# Altium schematic sheet Main.SchDoc
size A4; DocumentNumber: 1; SheetNumber: 1; SheetTotal: 6
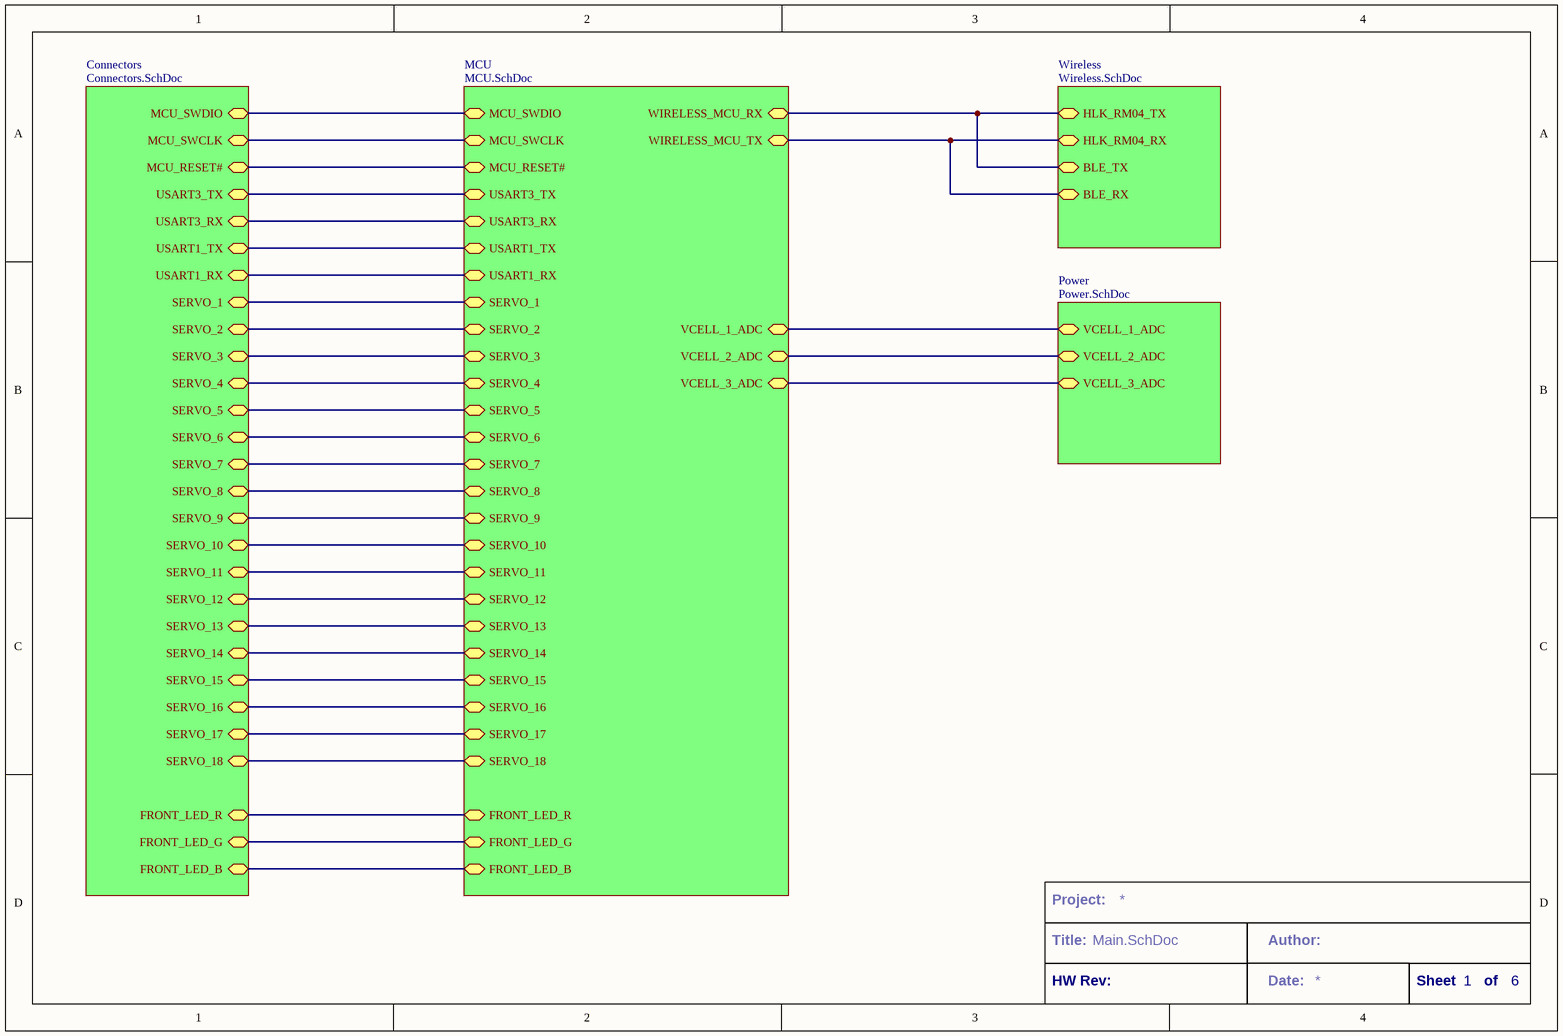
[diagram p0: Main.SchDoc]

## Sub-sheets
Connectors = Connectors.SchDoc: MCU_SWDIO, MCU_SWCLK, MCU_RESET#, USART3_TX, USART3_RX, USART1_TX, USART1_RX, SERVO_1, SERVO_2, SERVO_3, SERVO_4, SERVO_5, SERVO_6, SERVO_7, SERVO_8, SERVO_9, SERVO_10, SERVO_11, SERVO_12, SERVO_13, SERVO_14, SERVO_15, SERVO_16, SERVO_17, SERVO_18, FRONT_LED_B, FRONT_LED_G, FRONT_LED_R
MCU = MCU.SchDoc: MCU_SWDIO, MCU_SWCLK, MCU_RESET#, USART3_TX, USART3_RX, USART1_TX, USART1_RX, SERVO_1, SERVO_2, SERVO_3, SERVO_4, SERVO_5, SERVO_6, SERVO_7, SERVO_8, SERVO_9, SERVO_10, SERVO_11, SERVO_12, SERVO_13, SERVO_14, SERVO_15, SERVO_16, SERVO_17, SERVO_18, WIRELESS_MCU_TX, WIRELESS_MCU_RX, VCELL_1_ADC, VCELL_3_ADC, VCELL_2_ADC, FRONT_LED_R, FRONT_LED_G, FRONT_LED_B
Power = Power.SchDoc: VCELL_1_ADC, VCELL_3_ADC, VCELL_2_ADC
Wireless = Wireless.SchDoc: HLK_RM04_TX, HLK_RM04_RX, BLE_RX, BLE_TX

## Nets
(unnamed): sheet Connectors/MCU_SWDIO, sheet MCU/MCU_SWDIO
(unnamed): sheet Connectors/MCU_SWCLK, sheet MCU/MCU_SWCLK
(unnamed): sheet Connectors/MCU_RESET#, sheet MCU/MCU_RESET#
(unnamed): sheet Connectors/USART3_TX, sheet MCU/USART3_TX
(unnamed): sheet Connectors/USART3_RX, sheet MCU/USART3_RX
(unnamed): sheet Connectors/USART1_TX, sheet MCU/USART1_TX
(unnamed): sheet Connectors/USART1_RX, sheet MCU/USART1_RX
(unnamed): sheet Connectors/SERVO_1, sheet MCU/SERVO_1
(unnamed): sheet Connectors/SERVO_2, sheet MCU/SERVO_2
(unnamed): sheet Connectors/SERVO_3, sheet MCU/SERVO_3
(unnamed): sheet Connectors/SERVO_4, sheet MCU/SERVO_4
(unnamed): sheet Connectors/SERVO_5, sheet MCU/SERVO_5
(unnamed): sheet Connectors/SERVO_6, sheet MCU/SERVO_6
(unnamed): sheet Connectors/SERVO_7, sheet MCU/SERVO_7
(unnamed): sheet Connectors/SERVO_8, sheet MCU/SERVO_8
(unnamed): sheet Connectors/SERVO_9, sheet MCU/SERVO_9
(unnamed): sheet Connectors/SERVO_10, sheet MCU/SERVO_10
(unnamed): sheet Connectors/SERVO_11, sheet MCU/SERVO_11
(unnamed): sheet Connectors/SERVO_12, sheet MCU/SERVO_12
(unnamed): sheet Connectors/SERVO_13, sheet MCU/SERVO_13
(unnamed): sheet Connectors/SERVO_14, sheet MCU/SERVO_14
(unnamed): sheet Connectors/SERVO_15, sheet MCU/SERVO_15
(unnamed): sheet Connectors/SERVO_16, sheet MCU/SERVO_16
(unnamed): sheet Connectors/SERVO_17, sheet MCU/SERVO_17
(unnamed): sheet Connectors/SERVO_18, sheet MCU/SERVO_18
(unnamed): sheet Connectors/FRONT_LED_B, sheet MCU/FRONT_LED_B
(unnamed): sheet Connectors/FRONT_LED_G, sheet MCU/FRONT_LED_G
(unnamed): sheet Connectors/FRONT_LED_R, sheet MCU/FRONT_LED_R
(unnamed): sheet MCU/WIRELESS_MCU_TX, sheet Wireless/HLK_RM04_RX, sheet Wireless/BLE_RX
(unnamed): sheet MCU/WIRELESS_MCU_RX, sheet Wireless/HLK_RM04_TX, sheet Wireless/BLE_TX
(unnamed): sheet MCU/VCELL_1_ADC, sheet Power/VCELL_1_ADC
(unnamed): sheet MCU/VCELL_3_ADC, sheet Power/VCELL_3_ADC
(unnamed): sheet MCU/VCELL_2_ADC, sheet Power/VCELL_2_ADC

## Notes on the sheet
- Project:
- Title:
- HW Rev:
- Author:
- Date:
- Sheet
- of